# Altium schematic sheet 四通道输出运算放大（2）.SchDoc
size A4
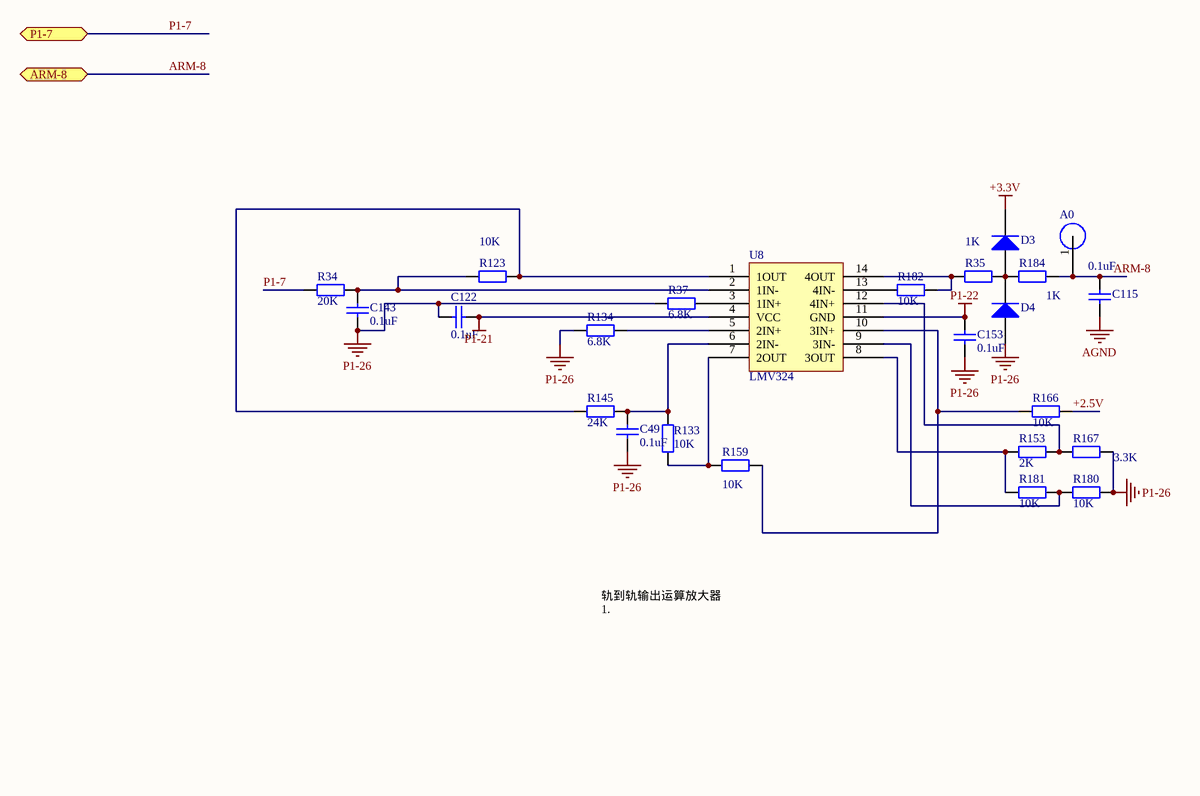
[diagram p0: 四通道输出运算放大（2）.SchDoc]

## Parts
A0  PIN  [圆形焊盘]  (value not drawn)
C49  value 0.1uF  [C0805]  (hidden comment: Cap)
C115  value 0.1uF  [C0805]  (hidden comment: Cap)
C122  value 0.1uF  [C0805]  (hidden comment: Cap)
C143  value 0.1uF  [C0805]  (hidden comment: Cap)
C153  value 0.1uF  [C0805]  (hidden comment: Cap)
D3  Diode 1N4007  [SOD123]  (value not drawn)
D4  Diode 1N4007  [SOD123]  (value not drawn)
R34  value 20K  [R0805]  (hidden comment: Res2)
R35  value 1K  [R0805]  (hidden comment: Res2)
R37  value 6.8K  [R0805]  (hidden comment: Res2)
R123  value 10K  [R0805]  (hidden comment: Res2)
R133  value 10K  [R0805]  (hidden comment: Res2)
R134  value 6.8K  [R0805]  (hidden comment: Res2)
R145  value 24K  [R0805]  (hidden comment: Res2)
R153  value 2K  [R0805]  (hidden comment: Res2)
R159  value 10K  [R0805]  (hidden comment: Res2)
R166  value 10K  [R0805]  (hidden comment: Res2)
R167  value 3.3K  [R0805]  (hidden comment: Res2)
R180  value 10K  [R0805]  (hidden comment: Res2)
R181  value 10K  [R0805]  (hidden comment: Res2)
R182  value 10K  [R0805]  (hidden comment: Res2)
R184  value 1K  [R0805]  (hidden comment: Res2)
U8  LMV324  [SOP-14]

## Ports
ARM-8, P1-7

## Nets
+3.3V: D3.2(K)
AGND: C115.1
P1-21: C122.2 U8.4(VCC)
P1-22: C153.1 U8.11(GND)
P1-26: C49.2 C122.1 C143.2 C153.2 D4.1(A) R37.1 R134.1 R167.2 R180.1
+2.5V: R166.1
ARM-8: A0.1 C115.2 R184.2 ; port ARM-8
P1-7: R34.1 ; port P1-7
NetC49_1: C49.1 R133.2 R145.2 U8.6(2IN-)
NetC143_1: C143.1 R34.2 R123.2 U8.2(1IN-)
NetD3_1: D3.1(A) D4.2(K) R35.2 R184.1
NetR35_1: R35.1 R182.1 U8.14(4OUT)
NetR37_2: R37.2 U8.3(1IN+)
NetR123_1: R123.1 R145.1 U8.1(1OUT)
NetR133_1: R133.1 R159.1 U8.7(2OUT)
NetR134_2: R134.2 U8.5(2IN+)
NetR153_1: R153.1 R167.1 U8.12(4IN+)
NetR153_2: R153.2 R181.2 U8.8(3OUT)
NetR159_2: R159.2 R166.2 U8.10(3IN+)
NetR180_2: R180.2 R181.1 U8.9(3IN-)
NetR182_2: R182.2 U8.13(4IN-)

## Notes on the sheet
- 轨到轨输出运算放大器
  1.

## Library data of the parts
A0 U8 = Component_1
C49 C115 C122 C143 C153 = Cap: Capacitor; Published: 8-Jun-2000; LatestRevisionDate: 17-Jul-2002; LatestRevisionNote: Re-released for DXP Platform.; PackageReference: RAD-0.3; Publisher: Altium Limited
D3 D4 = Diode 1N4007: 1 Amp General Purpose Rectifier; Published: 8-Jun-2000; LatestRevisionDate: 17-Jul-2002; LatestRevisionNote: Re-released for DXP Platform.; DatasheetDocument: 1998; PackageDocument: Aug-1999; PackageReference: DO-41; Publisher: Altium Limited; Code_JEDEC: DO-204-AL; ComponentLink1Description: Manufacturer Link; ComponentLink1URL: http://www.fairchildsemi.com/; ComponentLink2Description: Datasheet; ComponentLink2URL: http://www.fairchildsemi.com/ds/1N%2F1N4001.pdf
R34 R35 R37 R123 R133 R134 R145 R153 R159 R166 R167 R180-R182 R184 = Res2: Resistor; Published: 8-Jun-2000; LatestRevisionDate: 17-Jul-2002; LatestRevisionNote: Re-released for DXP Platform.; PackageReference: AXIAL-0.4; Publisher: Altium Limited